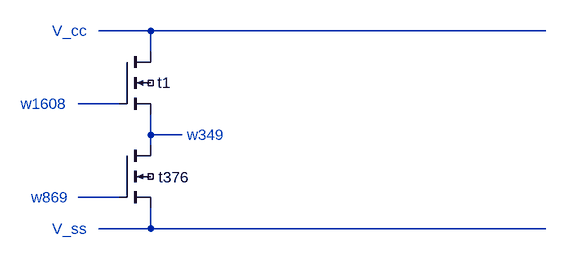
[diagram p0: schematic transdef.asc]
transdef.asc, the LTspice schematic file:
Version 4
SHEET 1 1268 680
WIRE 656 288 576 288
WIRE 1264 288 656 288
WIRE 656 320 656 288
WIRE 608 400 544 400
WIRE 656 448 656 416
WIRE 704 448 656 448
WIRE 656 464 656 448
WIRE 608 544 544 544
WIRE 656 592 656 560
WIRE 656 592 576 592
WIRE 1264 592 656 592
SYMBOL nmos4 608 320 R0
WINDOW 0 59 48 Left 2
SYMATTR InstName t1
SYMATTR Value ""
SYMBOL nmos4 608 464 R0
WINDOW 0 60 49 Left 2
SYMATTR InstName t376
SYMATTR Value ""
TEXT 456 400 Left 2 ;w1608
TEXT 472 544 Left 2 ;w869
TEXT 712 448 Left 2 ;w349
TEXT 504 288 Left 2 ;V_cc
TEXT 504 592 Left 2 ;V_ss

The netlist it stands for:
* transdef.asc
M§t1 N001 N002 N003 NC_01
M§t376 N003 N004 N005 NC_02
.model NMOS NMOS
.model PMOS PMOS
.lib standard.mos
* w1608
* w869
* w349
* V_cc
* V_ss
.backanno
.end